# Altium schematic sheet 14.SchDoc
size 513 x 386 mm
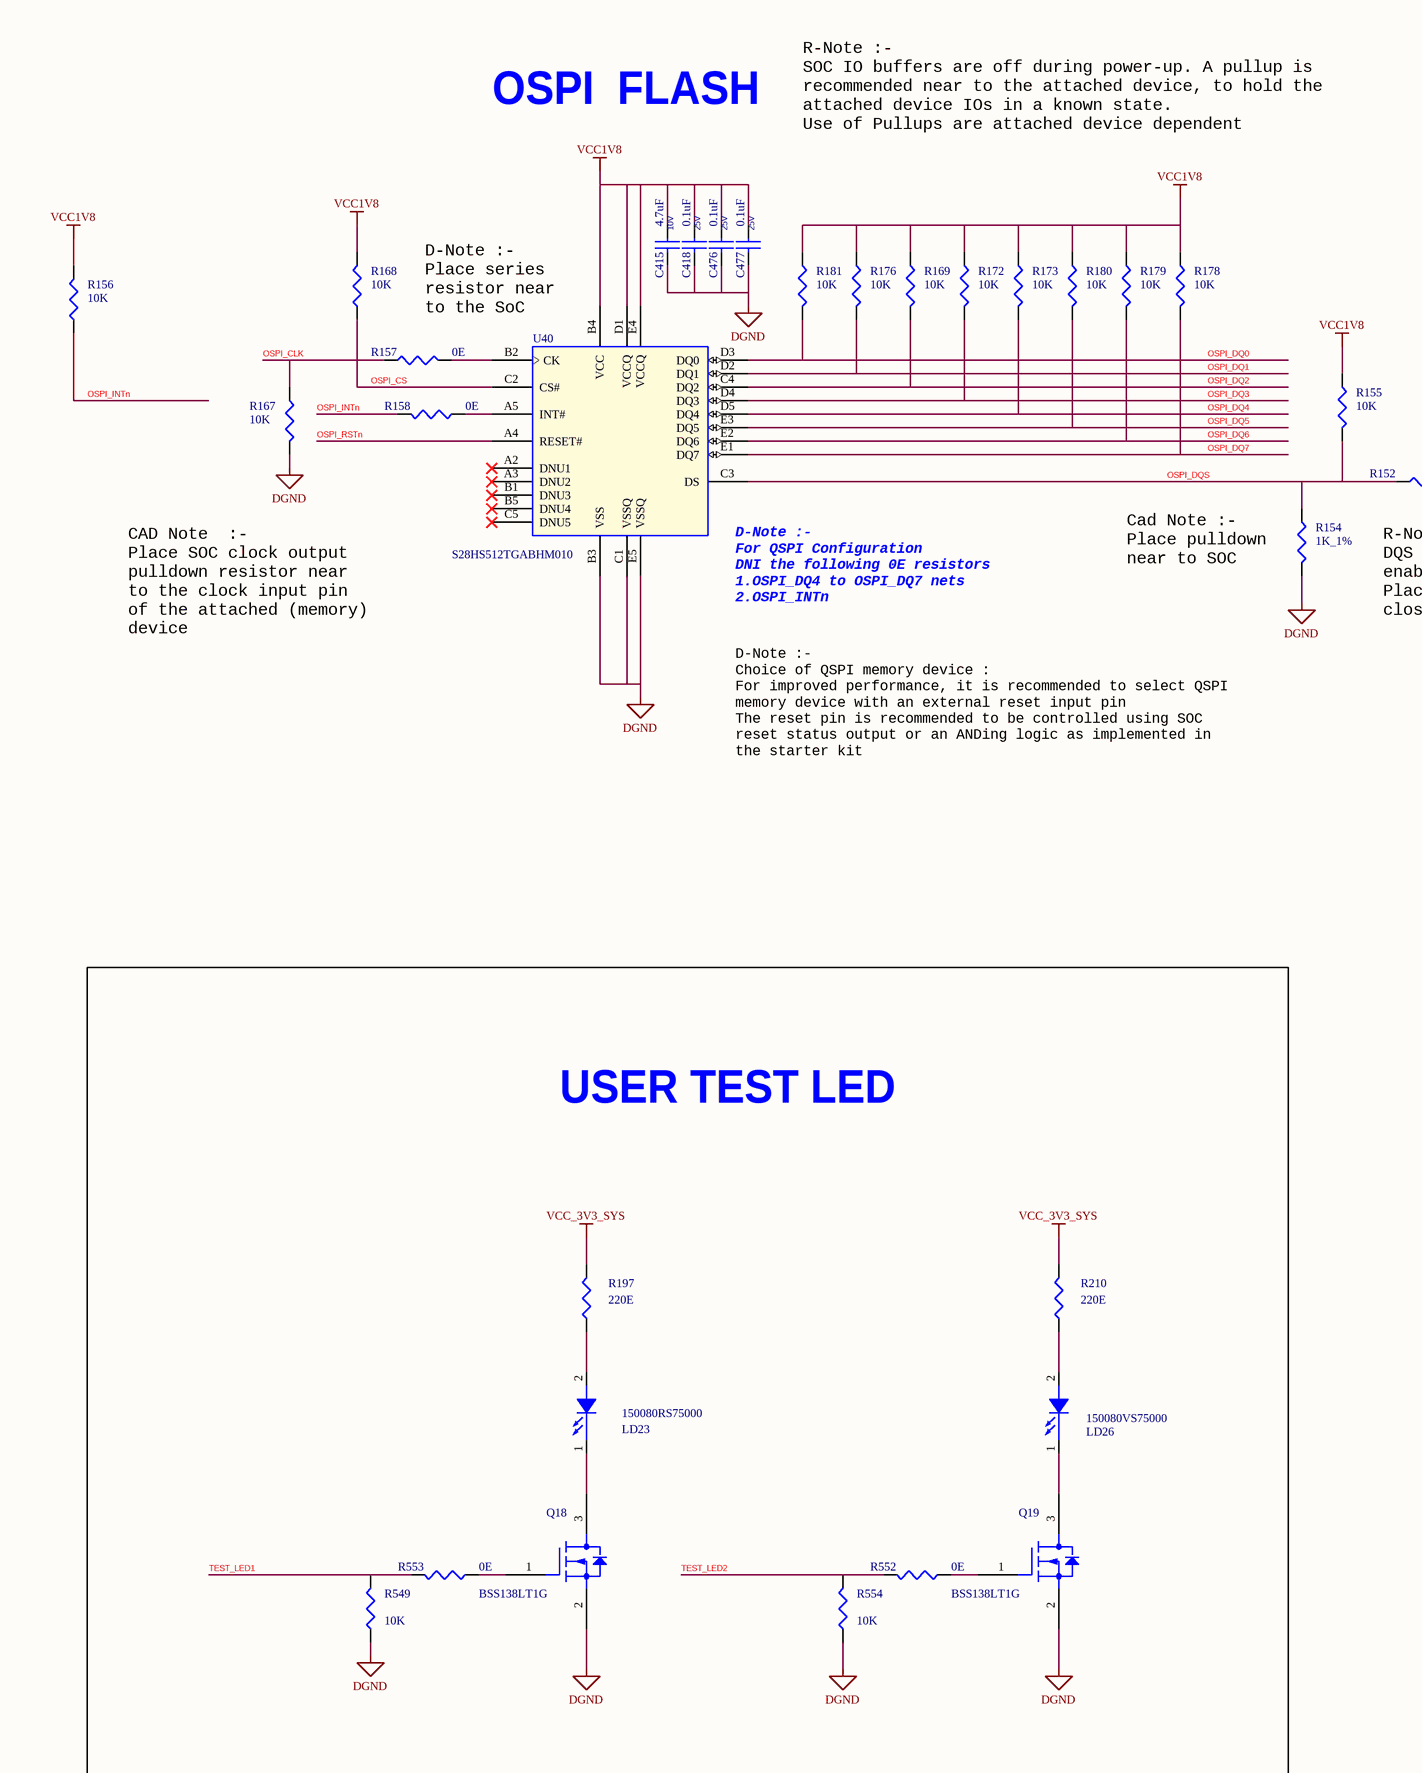
[diagram p0: 14.SchDoc, left]
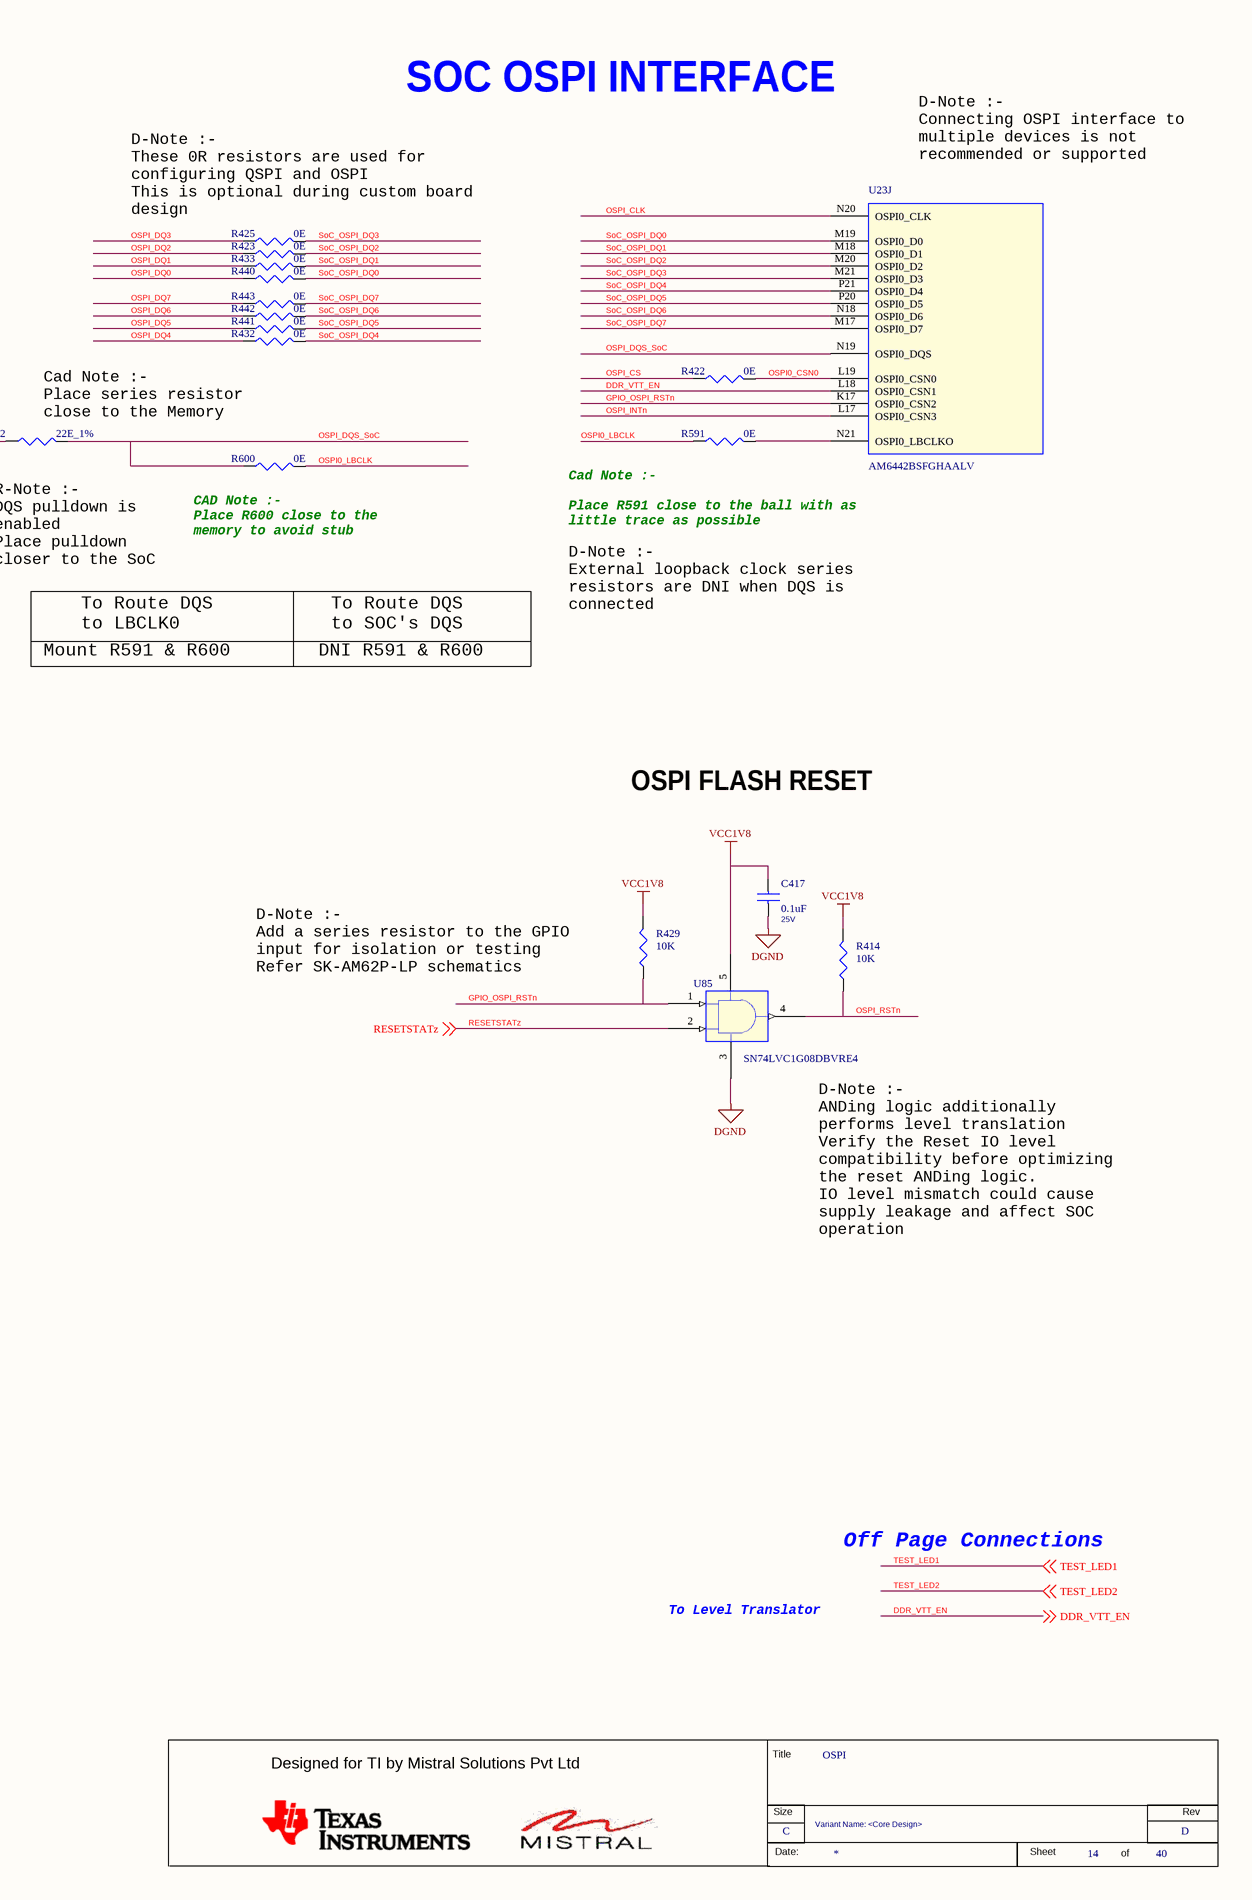
[diagram p1: 14.SchDoc, right]

## Parts
*  RevCode: D  Title: OSPI  Page Size: C  Page Number: 14  Page Count: 40  Variant Name: <Core Design>  (hidden comment: MISTRAL_TITLEBLK_CSIZE)  (graphical)
C415  4.7uF  Voltage: 10V  [CAP0402_0-75]
C417  0.1uF  Voltage: 25V  [CAP0402_0-75]
C418  0.1uF  Voltage: 25V  [CAP0402_0-75]
C476  0.1uF  Voltage: 25V  [CAP0402_0-75]
C477  0.1uF  Voltage: 25V  [CAP0402_0-75]
LD23  150080RS75000  [LED_150080VS75000_80X50_SMD_0-8]
LD26  150080VS75000  [LED_150080VS75000_80X50_SMD_0-8]
Q18  BSS138LT1G  [SOT23-123_1-2]
Q19  BSS138LT1G  [SOT23-123_1-2]
R152  22E_1%  [RES0402_0-5]
R154  1K_1%  [RES0402_0-5]
R155  10K  [RES0402_0-5]
R156  10K  [RES0402_0-5]
R157  0E  [RES0402N]
R158  0E  [RES0402_0-5]
R167  10K  [RES0402_0-5]
R168  10K  [RES0402_0-5]
R169  10K  [RES0402_0-5]
R172  10K  [RES0402_0-5]
R173  10K  [RES0402_0-5]
R176  10K  [RES0402_0-5]
R178  10K  [RES0402_0-5]
R179  10K  [RES0402_0-5]
R180  10K  [RES0402_0-5]
R181  10K  [RES0402_0-5]
R197  220E  [RES0402_0-5]
R210  220E  [RES0402_0-5]
R414  10K  [RES0402_0-5]
R422  0E  [RES0402_0-5]
R423  0E  [RES0402_0-5]
R425  0E  [RES0402_0-5]
R429  10K  [RES0402_0-5]
R432  0E  [RES0402_0-5]
R433  0E  [RES0402_0-5]
R440  0E  [RES0402_0-5]
R441  0E  [RES0402_0-5]
R442  0E  [RES0402_0-5]
R443  0E  [RES0402_0-5]
R549  10K  [RES0402_0-5]
R552  0E  [RES0402_0-5]
R553  0E  [RES0402_0-5]
R554  10K  [RES0402_0-5]
R591  0E  [RES0402_0-5]
R600  0E  [RES0402_0-5]
U23  AM6442BSFGHAALV  [FCBGA441_31-49_680X680_2-6]  (part J of 16)
U40  S28HS512TGABHM010  [BGA24_39-37_240X310_1]
U85  SN74LVC1G08DBVRE4  [SOT23-5]

## Blocks framed on the sheet
USER TEST LED: LD23 LD26 Q18 Q19 R197 R210 R549 R552-R554

## Nets
DGND: C415.2 C417.2 C418.2 C476.2 C477.2 Q18.2(S) Q19.2(S) R154.2 R167.2 R549.1 R554.1 U40.B3(VSS) U40.C1(VSSQ) U40.E5(VSSQ) U85.3(GND)
VCC1V8: C415.1 C417.1 C418.1 C476.1 C477.1 R155.1 R156.2 R168.2 R169.1 R172.1 R173.1 R176.1 R178.1 R179.1 R180.1 R181.1 R414.2 R429.2 U40.B4(VCC) U40.D1(VCCQ) U40.E4(VCCQ) U85.5(VCC)
VCC_3V3_SYS: R197.2 R210.2
DDR_VTT_EN: U23.L18(OSPI0_CSN1) ; off-sheet DDR_VTT_EN
GPIO_OSPI_RSTn: R429.1 U23.K17(OSPI0_CSN2) U85.1(A)
OSPI0_CSN0: R422.2 U23.L19(OSPI0_CSN0)
OSPI0_LBCLK: R591.1 R600.2
OSPI_CLK: R157.1 R167.1 U23.N20(OSPI0_CLK)
OSPI_CS: R168.1 R422.1 U40.C2(CS#)
OSPI_DQ0: R181.2 R440.1 U40.D3(DQ0)
OSPI_DQ1: R176.2 R433.1 U40.D2(DQ1)
OSPI_DQ2: R169.2 R423.1 U40.C4(DQ2)
OSPI_DQ3: R172.2 R425.1 U40.D4(DQ3)
OSPI_DQ4: R173.2 R432.1 U40.D5(DQ4)
OSPI_DQ5: R180.2 R441.1 U40.E3(DQ5)
OSPI_DQ6: R179.2 R442.1 U40.E2(DQ6)
OSPI_DQ7: R178.2 R443.1 U40.E1(DQ7)
OSPI_DQS: R152.1 R154.1 R155.2 U40.C3(DS)
OSPI_DQS_SoC: R152.2 R600.1 U23.N19(OSPI0_DQS)
OSPI_INTn: R156.1 R158.2 U23.L17(OSPI0_CSN3)
OSPI_RSTn: R414.1 U40.A4(RESET#) U85.4(Y)
RESETSTATz: U85.2(B) ; off-sheet RESETSTATz
SoC_OSPI_DQ0: R440.2 U23.M19(OSPI0_D0)
SoC_OSPI_DQ1: R433.2 U23.M18(OSPI0_D1)
SoC_OSPI_DQ2: R423.2 U23.M20(OSPI0_D2)
SoC_OSPI_DQ3: R425.2 U23.M21(OSPI0_D3)
SoC_OSPI_DQ4: R432.2 U23.P21(OSPI0_D4)
SoC_OSPI_DQ5: R441.2 U23.P20(OSPI0_D5)
SoC_OSPI_DQ6: R442.2 U23.N18(OSPI0_D6)
SoC_OSPI_DQ7: R443.2 U23.M17(OSPI0_D7)
TEST_LED1: R549.2 R553.2 ; off-sheet TEST_LED1
TEST_LED2: R552.2 R554.2 ; off-sheet TEST_LED2
NetLD23_1: LD23.1(CATHODE) Q18.3(D)
NetLD23_2: LD23.2(ANODE) R197.1
NetLD26_1: LD26.1(CATHODE) Q19.3(D)
NetLD26_2: LD26.2(ANODE) R210.1
NetQ18_1: Q18.1(G) R553.1
NetQ19_1: Q19.1(G) R552.1
NetR157_2: R157.2 U40.B2(CK)
NetR158_1: R158.1 U40.A5(INT#)
NetR591_2: R591.2 U23.N21(OSPI0_LBCLKO)

Not connected (* = marked no-connect by the designer): U40 A2(DNU1)* A3(DNU2)* B1(DNU3)* B5(DNU4)* C5(DNU5)*

## Notes on the sheet
- R-Note :-
  SOC IO buffers are off during power-up. A pullup is
  recommended near to the attached device, to hold the
  attached device IOs in a known state.
  Use of Pullups are attached device dependent
- D-Note :-
  Connecting OSPI interface to
  multiple devices is not
  recommended or supported
- OSPI  FLASH
- D-Note :-
  These 0R resistors are used for
  configuring QSPI and OSPI
  This is optional during custom board
  design
- SOC OSPI INTERFACE
- D-Note :-
  Place series
  resistor near
  to the SoC
- Cad Note :-
  Place series resistor
  close to the Memory
- (near R154) Cad Note :-
  Place pulldown
  near to SOC
- Cad Note :-
  Place R591 close to the ball with as
  little trace as possible
- CAD Note  :-
  Place SOC clock output
  pulldown resistor near
  to the clock input pin
  of the attached (memory)
  device
- (near U40) D-Note :-
  For QSPI Configuration
  DNI the following 0E resistors
  1.OSPI_DQ4 to OSPI_DQ7 nets
  2.OSPI_INTn
- (near R152) R-Note :-
  DQS pulldown is
  enabled
  Place pulldown
  closer to the SoC
- (near R600) CAD Note :-
  Place R600 close to the
  memory to avoid stub
- D-Note :-
  Choice of QSPI memory device :
  For improved performance, it is recommended to select QSPI
  memory device with an external reset input pin
  The reset pin is recommended to be controlled using SOC
  reset status output or an ANDing logic as implemented in
  the starter kit
- To Route DQS
  to LBCLK0
- To Route DQS
  to SOC's DQS
- D-Note :-
  External loopback clock series
  resistors are DNI when DQS is
  connected
- Mount R591 & R600
- DNI R591 & R600
- OSPI FLASH RESET
- D-Note :-
  Add a series resistor to the GPIO
  input for isolation or testing
  Refer SK-AM62P-LP schematics
- D-Note :-
  ANDing logic additionally
  performs level translation
  Verify the Reset IO level
  compatibility before optimizing
  the reset ANDing logic.
  IO level mismatch could cause
  supply leakage and affect SOC
  operation
- Off Page Connections
- To Level Translator
- (in symbol MISTRAL_TITLEBLK_CSIZE) Title; Designed for TI by Mistral Solutions Pvt Ltd; Size; Rev; Date:; Sheet; of

## Library data of the parts
* = MISTRAL_TITLEBLK_CSIZE: Issue: 1.0; Page Create Date: March  8, 1995; Page Modify Date: *
C415 = CAP_Dup3: CAP CERAMIC 4.7uF 10V 20% X5R 0402; Mistral Part No: 120012060002-R; Mfr_name: AVX CORPORATION; Mfr_part_number: 0402ZD475MAT2A; Part_type: CAPACITORS\CERAMIC; Project: TI_MAXIE_CPB; Wattage: NA; Customs_HS_Code: 85322990; Custom_Duty: 15%; PCB Footprint: CAP0402_0-75; Footprint Path: Y:\MIS_DATABASE\Library\ALTIUM_TOOL\PCB_FOOTPRINTS\Altium_Footprint_Lib.PcbLib; Library Path: Y:\MIS_DATABASE\Library\ALTIUM_TOOL\SCHEMATICS_PARTS\MS_DISCRETE_Library.schlib; Footprint Ref: CAP0402_0-75; Tolerance: 20%; Package: 0402; Distributor_name: DIGIKEY; Distributor_part_number: 478-10791-1-ND; Height: 0.71MM; Weight: 0.65mg; Temperature: -55癈+85癈; Datasheet: Y:\MIS_DATABASE\DATASHEETS\CAPACITORS\AVX_MLC.PDF; Crtd /date: MANIRAJA/230118; Chkd/date: MANIRAJA/230118; MECHANICAL 3D STEP FILE: CAP0402_0-75; Library Ref: CAP
C417 C418 C477 = CAP_Dup3: CAP CERAMIC 0.1uF 25V 20% X5R 0402; Alt_Mfr_name: YAGEO AMERICA; Part_type: CAPACITORS\CERAMIC; Mfr_part_number: 885012105018; Mfr_name: WURTH ELECTRONICS; Mistral Part No: 120020080003-R; Alt_Mfr_part_number: CC0402KRX5R8BB104; Custom_Duty: 15%; Customs_HS_Code: 85322990; Wattage: NA; Project: AM64x_EVM_BRD; PCB Footprint: CAP0402_0-75; Footprint Path: Y:\MIS_DATABASE\Library\ALTIUM_TOOL\PCB_FOOTPRINTS\Altium_Footprint_Lib.PcbLib; Library Path: Y:\MIS_DATABASE\Library\ALTIUM_TOOL\SCHEMATICS_PARTS\MS_DISCRETE_Library.schlib; Footprint Ref: CAP0402_0-75; Library Ref: CAP; MECHANICAL 3D STEP FILE: CAP0402_0-75; Chkd/date: MANIRAJA/170820; Crtd /date: ALVY/170820; Datasheet: Y:\MIS_DATABASE\DATASHEETS\CAPACITORS\885012105018.PDF; Temperature: -55癈+85癈; Weight: 0.65mg; Height: 0.55MM; Distributor_part_number: 732-7495-1-ND; Distributor_name: DIGIKEY; Package: 0402; Tolerance: 20%
C476 = CAP_Dup3: CAP CERAMIC 0.1uF 25V 20% X5R 0402; Alt_Mfr_part_number: CC0402KRX5R8BB104; Mistral Part No: 120020080003-R; Mfr_name: WURTH ELECTRONICS; Mfr_part_number: 885012105018; Part_type: CAPACITORS\CERAMIC; Alt_Mfr_name: YAGEO AMERICA; Project: AM64x_EVM_BRD; Wattage: NA; Customs_HS_Code: 85322990; Custom_Duty: 15%; PCB Footprint: CAP0402_0-75; Tolerance: 20%; Package: 0402; Distributor_name: DIGIKEY; Distributor_part_number: 732-7495-1-ND; Height: 0.55MM; Weight: 0.65mg; Temperature: -55癈+85癈; Datasheet: Y:\MIS_DATABASE\DATASHEETS\CAPACITORS\885012105018.PDF; Crtd /date: ALVY/170820; Chkd/date: MANIRAJA/170820; MECHANICAL 3D STEP FILE: CAP0402_0-75; Library Ref: CAP; Footprint Ref: CAP0402_0-75; Library Path: Y:\MIS_DATABASE\Library\ALTIUM_TOOL\SCHEMATICS_PARTS\MS_DISCRETE_Library.schlib; Footprint Path: Y:\MIS_DATABASE\Library\ALTIUM_TOOL\PCB_FOOTPRINTS\Altium_Footprint_Lib.PcbLib
LD23 = DIODE_LED: DIODE LED RED SMD; Part_type: OPTO\LED; Mfr_name: WURTH ELECTRONICS; Mistral Part No: 130020080013-R; Custom_Duty: 24%; Customs_HS_Code: 85439000; Wattage: NA; Project: AM64x_EVM_BRD; Footprint Path: Y:\MIS_DATABASE\Library\ALTIUM_TOOL\PCB_FOOTPRINTS\Altium_Footprint_Lib.PcbLib; Library Path: Y:\MIS_DATABASE\Library\ALTIUM_TOOL\SCHEMATICS_PARTS\MS_OPTO_Library.schlib; MECHANICAL 3D STEP FILE: LED_150080VS75000_80X50_SMD_0-8; Chkd/date: MANIRAJA/180820; Crtd /date: ALVY/180820; Datasheet: Y:\MIS_DATABASE\DATASHEETS\DISCRETES\LEDS\150080RS75000.PDF; Temperature: -40癈+85癈; Weight: 25mg; Height: 0.80MM; Library Ref: DIODE_LED; Distributor_part_number: 732-4984-1-ND; Distributor_name: DIGIKEY; Package: SMD; Voltage: NA; Tolerance: NA; Mfr_part_number: 150080RS75000; Footprint Ref: LED_150080VS75000_80X50_SMD_0-8; PCB Footprint: LED_150080VS75000_80X50_SMD_0-8
LD26 = DIODE_LED: DIODE LED BRIGHT GREEN SMD; Mistral Part No: 130020080012-R; Mfr_name: WURTH ELECTRONICS; Part_type: OPTO\LED; Project: AM64x_EVM_BRD; Tolerance: NA; Customs_HS_Code: 85439000; Custom_Duty: 24%; Mfr_part_number: 150080VS75000; Voltage: NA; Wattage: NA; Package: SMD; Distributor_name: DIGIKEY; Distributor_part_number: 732-4986-1-ND; Library Ref: DIODE_LED; Footprint Ref: LED_150080VS75000_80X50_SMD_0-8; Height: 0.80MM; Weight: 10mg; Temperature: -40癈+85癈; Datasheet: Y:\MIS_DATABASE\DATASHEETS\DISCRETES\LEDS\150080VS75000.PDF; Crtd /date: ALVY/180820; Chkd/date: MANIRAJA/180820; MECHANICAL 3D STEP FILE: LED_150080VS75000_80X50_SMD_0-8; Library Path: Y:\MIS_DATABASE\Library\ALTIUM_TOOL\SCHEMATICS_PARTS\MS_OPTO_Library.schlib; Footprint Path: Y:\MIS_DATABASE\Library\ALTIUM_TOOL\PCB_FOOTPRINTS\Altium_Footprint_Lib.PcbLib; PCB Footprint: LED_150080VS75000_80X50_SMD_0-8
Q18 = MOSFET_BSS138LT1G: IC MOSFET N-CHANNEL 50V 200mA SOT23-3; Part_type: ICS\POWER\MOSFET; Mfr_name: ON SEMICONDUCTOR; Mistral Part No: 142016040001-R; Custom_Duty: 15%; Customs_HS_Code: 85423100; Wattage: NA; Project: LRDE_ABCM; PCB Footprint: SOT23-123_1-2; Footprint Path: Y:\MIS_DATABASE\Library\ALTIUM_TOOL\PCB_FOOTPRINTS\Altium_Footprint_Lib.PcbLib; Library Path: Y:\MIS_DATABASE\Library\ALTIUM_TOOL\SCHEMATICS_PARTS\MS_MOSFET_Library.schlib; MECHANICAL 3D STEP FILE: SOT23-123_1-2; Footprint Ref: SOT23-123_1-2; Chkd/date: MANIRAJA/250219; Crtd /date: JEBRAN/060416; Datasheet: Y:\MIS_DATABASE\DATASHEETS\DISCRETES\TRANSISTORS_FETS\BSS138LT1G.PDF; Temperature: -55癈+150癈; Weight: 8mg; Height: 1.11MM; Distributor_part_number: BSS138LT1GOSCT-ND; Distributor_name: DIGIKEY; Package: SOT23-3; Voltage: NA; Tolerance: NA; Mfr_part_number: BSS138LT1G; Library Ref: MOSFET_BSS138W
Q19 = MOSFET_BSS138LT1G: IC MOSFET N-CHANNEL 50V 200mA SOT23-3; Mistral Part No: 142016040001-R; Mfr_name: ON SEMICONDUCTOR; Part_type: ICS\POWER\MOSFET; Project: LRDE_ABCM; Tolerance: NA; Customs_HS_Code: 85423100; Custom_Duty: 15%; PCB Footprint: SOT23-123_1-2; Library Ref: MOSFET_BSS138W; Mfr_part_number: BSS138LT1G; Voltage: NA; Wattage: NA; Package: SOT23-3; Distributor_name: DIGIKEY; Distributor_part_number: BSS138LT1GOSCT-ND; Height: 1.11MM; Weight: 8mg; Temperature: -55癈+150癈; Datasheet: Y:\MIS_DATABASE\DATASHEETS\DISCRETES\TRANSISTORS_FETS\BSS138LT1G.PDF; Crtd /date: JEBRAN/060416; Chkd/date: MANIRAJA/250219; Footprint Ref: SOT23-123_1-2; MECHANICAL 3D STEP FILE: SOT23-123_1-2; Library Path: Y:\MIS_DATABASE\Library\ALTIUM_TOOL\SCHEMATICS_PARTS\MS_MOSFET_Library.schlib; Footprint Path: Y:\MIS_DATABASE\Library\ALTIUM_TOOL\PCB_FOOTPRINTS\Altium_Footprint_Lib.PcbLib
R152 = RESISTOR_Dup5: RES 22E 1/16W 1% 0402; Cust_part_number: 4700-80047E; Part_type: RESISTORS\FIXED; Mfr_part_number: RC0402FR-0722RL; Mfr_name: YAGEO AMERICA; Mistral Part No: 110009090004-R; Custom_Duty: 15%; Customs_HS_Code: 85332119; Voltage: NA; Project: VMEFMCD; SIGNAL_MODEL: RESISTOR_RES0402_22E_22E; PCB Footprint: RES0402_0-5; Footprint Path: Y:\MIS_DATABASE\Library\ALTIUM_TOOL\PCB_FOOTPRINTS\Altium_Footprint_Lib.PcbLib; Library Path: Y:\MIS_DATABASE\Library\ALTIUM_TOOL\SCHEMATICS_PARTS\MS_DISCRETE_Library.schlib; MECHANICAL 3D STEP FILE: RES0402_0-5; Footprint Ref: RES0402_0-5; Chkd/date: SUHAS/290910; Crtd /date: MAZHAR/090909; Datasheet: Y:\MIS_DATABASE\DATASHEETS\RESISTORS\RCXXXXL-SER_MAR18.PDF; Temperature: -55癈+155癈; Weight: 0.65mg; Height: 0.40MM; Distributor_part_number: 311-22.0LRCT-ND; Distributor_name: DIGIKEY; Package: 0402; Wattage: 1/16W; Tolerance: 1%; Library Ref: RESISTOR
R154 = RESISTOR_Dup5: RES 1K 1/10W 1% 0402; Part_type: RESISTORS\FIXED; Mfr_part_number: ERJ-2RKF1001X; Mfr_name: PANASONIC-ECG; Mistral Part No: 110009030411-R; Custom_Duty: 15%; Customs_HS_Code: 85332119; Voltage: NA; Project: VOCERA; PCB Footprint: RES0402_0-5; Chkd/date: VASANTHA/281216; Crtd /date: MAZHAR/150506; Datasheet: Y:\MIS_DATABASE\DATASHEETS\RESISTORS\PAN-ERJSER_NOV17.PDF; Temperature: -55癈+155癈; Weight: 0.8mg; Height: 0.40MM; Distributor_part_number: P1.00KLCT-ND; Distributor_name: DIGIKEY; Package: 0402; Wattage: 1/10W; Tolerance: 1%; Library Ref: RESISTOR; Footprint Ref: RES0402_0-5; MECHANICAL 3D STEP FILE: RES0402_0-5; Library Path: Y:\MIS_DATABASE\Library\ALTIUM_TOOL\SCHEMATICS_PARTS\MS_DISCRETE_Library.schlib; Footprint Path: Y:\MIS_DATABASE\Library\ALTIUM_TOOL\PCB_FOOTPRINTS\Altium_Footprint_Lib.PcbLib
R155 R181 R429 R554 = RESISTOR_Dup6: RES 10K 1/16W 5% 0402; Mistral Part No: 110011060021-R; Mfr_name: YAGEO AMERICA; Mfr_part_number: RC0402JR-0710KL; Part_type: RESISTORS\FIXED; Project: HSE; Voltage: NA; Customs_HS_Code: 85332119; Custom_Duty: 15%; PCB Footprint: RES0402_0-5; Footprint Path: Y:\MIS_DATABASE\Library\ALTIUM_TOOL\PCB_FOOTPRINTS\Altium_Footprint_Lib.PcbLib; Library Path: Y:\MIS_DATABASE\Library\ALTIUM_TOOL\SCHEMATICS_PARTS\MS_DISCRETE_Library.schlib; Footprint Ref: RES0402_0-5; Library Ref: RESISTOR; Tolerance: 5%; Wattage: 1/16W; Package: 0402; Distributor_name: DIGIKEY; Distributor_part_number: 311-10KJRCT-ND; Height: 0.40MM; Weight: 0.65mg; Temperature: -55癈+155癈; Datasheet: Y:\MIS_DATABASE\DATASHEETS\RESISTORS\RCXXXXL-SER_MAR18.PDF; Crtd /date: MAZHAR/230805; Chkd/date: VASANTHA/061216; MECHANICAL 3D STEP FILE: RES0402_0-5
R156 R168 R169 R172 R173 R176 R178-R180 R414 R549 = RESISTOR_Dup6: RES 10K 1/16W 5% 0402; Part_type: RESISTORS\FIXED; Mfr_part_number: RC0402JR-0710KL; Mfr_name: YAGEO AMERICA; Mistral Part No: 110011060021-R; Custom_Duty: 15%; Customs_HS_Code: 85332119; Voltage: NA; Project: HSE; PCB Footprint: RES0402_0-5; Footprint Path: Y:\MIS_DATABASE\Library\ALTIUM_TOOL\PCB_FOOTPRINTS\Altium_Footprint_Lib.PcbLib; Library Path: Y:\MIS_DATABASE\Library\ALTIUM_TOOL\SCHEMATICS_PARTS\MS_DISCRETE_Library.schlib; Footprint Ref: RES0402_0-5; Library Ref: RESISTOR; MECHANICAL 3D STEP FILE: RES0402_0-5; Chkd/date: VASANTHA/061216; Crtd /date: MAZHAR/230805; Datasheet: Y:\MIS_DATABASE\DATASHEETS\RESISTORS\RCXXXXL-SER_MAR18.PDF; Temperature: -55癈+155癈; Weight: 0.65mg; Height: 0.40MM; Distributor_part_number: 311-10KJRCT-ND; Distributor_name: DIGIKEY; Package: 0402; Wattage: 1/16W; Tolerance: 5%
R157 = RESISTOR_Dup3: RES 0E 1/16W JUMPER 0402; Mistral Part No: 110010080019-R; Mfr_name: VISHAY; Mfr_part_number: CRCW04020000Z0ED; Part_type: RESISTORS\FIXED; PCB Footprint: RES0402_0-5; Voltage: NA; Project: PB_BUGBASE; Customs_HS_Code: 85332119; Custom_Duty: 15%; MECHANICAL 3D STEP FILE: RES0402_0-5; Temperature: -55癈+155癈; Weight: 0.65mg; Tolerance: NA; Wattage: 1/16W; Package: 0402; Distributor_name: DIGIKEY; Distributor_part_number: 541-0.0JCT-ND; Height: 0.40MM; Datasheet: Y:\MIS_DATABASE\DATASHEETS\RESISTORS\CRCW0603.PDF; Crtd /date: MUDDU/190810; Chkd/date: VASANTHA/201216; Library Ref: RESISTOR; Footprint Ref: RES0402_0-5; Library Path: Y:\MIS_DATABASE\Library\ALTIUM_TOOL\SCHEMATICS_PARTS\MS_DISCRETE_Library.schlib; Footprint Path: Y:\MIS_DATABASE\Library\ALTIUM_TOOL\PCB_FOOTPRINTS\Altium_Footprint_Lib.PcbLib
R158 R422 R432 R441-R443 R552 R591 R600 = RESISTOR_Dup5: RES 0E 1/16W JUMPER 0402; Mistral Part No: 110010080019-R; Mfr_name: VISHAY; Mfr_part_number: CRCW04020000Z0ED; Part_type: RESISTORS\FIXED; Project: PB_BUGBASE; Tolerance: NA; Customs_HS_Code: 85332119; Custom_Duty: 15%; PCB Footprint: RES0402_0-5; Footprint Path: Y:\MIS_DATABASE\Library\ALTIUM_TOOL\PCB_FOOTPRINTS\Altium_Footprint_Lib.PcbLib; Library Path: Y:\MIS_DATABASE\Library\ALTIUM_TOOL\SCHEMATICS_PARTS\MS_DISCRETE_Library.schlib; Footprint Ref: RES0402_0-5; Library Ref: RESISTOR; Voltage: NA; Wattage: 1/16W; Package: 0402; Distributor_name: DIGIKEY; Distributor_part_number: 541-0.0JCT-ND; Height: 0.40MM; Weight: 0.65mg; Temperature: -55癈+155癈; Datasheet: Y:\MIS_DATABASE\DATASHEETS\RESISTORS\CRCW0603.PDF; Crtd /date: MUDDU/190810; Chkd/date: VASANTHA/201216; MECHANICAL 3D STEP FILE: RES0402_0-5
R167 = RESISTOR_Dup5: RES 10K 1/16W 5% 0402; Part_type: RESISTORS\FIXED; Mfr_part_number: RC0402JR-0710KL; Mfr_name: YAGEO AMERICA; Mistral Part No: 110011060021-R; Custom_Duty: 15%; Customs_HS_Code: 85332119; Voltage: NA; Project: HSE; PCB Footprint: RES0402_0-5; Footprint Path: Y:\MIS_DATABASE\Library\ALTIUM_TOOL\PCB_FOOTPRINTS\Altium_Footprint_Lib.PcbLib; Library Path: Y:\MIS_DATABASE\Library\ALTIUM_TOOL\SCHEMATICS_PARTS\MS_DISCRETE_Library.schlib; Footprint Ref: RES0402_0-5; Chkd/date: VASANTHA/061216; Crtd /date: MAZHAR/230805; Datasheet: Y:\MIS_DATABASE\DATASHEETS\RESISTORS\RCXXXXL-SER_MAR18.PDF; Temperature: -55癈+155癈; Weight: 0.65mg; Height: 0.40MM; Distributor_part_number: 311-10KJRCT-ND; Distributor_name: DIGIKEY; Package: 0402; Wattage: 1/16W; Tolerance: 5%; MECHANICAL 3D STEP FILE: RES0402_0-5; Library Ref: RESISTOR
R197 = RESISTOR_Dup6: RES 220E 1/10W 5% 0402; Part_type: RESISTORS\FIXED; Mfr_part_number: ERJ-2GEJ221X; Mfr_name: PANASONIC-ECG; Mistral Part No: 110009030506-R; Custom_Duty: 15%; Customs_HS_Code: 85332119; Project: RED EYE; Voltage: NA; PCB Footprint: RES0402_0-5; Footprint Ref: RES0402_0-5; Chkd/date: VASANTHA/291216; Crtd /date: GEETHA/260406; Datasheet: Y:\MIS_DATABASE\DATASHEETS\RESISTORS\PAN-ERJSER_NOV17.PDF; Height: 0.40MM; Distributor_part_number: P220JCT-ND; Distributor_name: DIGIKEY; Package: 0402; Wattage: 1/10W; Tolerance: 5%; Library Ref: RESISTOR; Weight: 0.8mg; Temperature: -55癈+155癈; MECHANICAL 3D STEP FILE: RES0402_0-5; Library Path: Y:\MIS_DATABASE\Library\ALTIUM_TOOL\SCHEMATICS_PARTS\MS_DISCRETE_Library.schlib; Footprint Path: Y:\MIS_DATABASE\Library\ALTIUM_TOOL\PCB_FOOTPRINTS\Altium_Footprint_Lib.PcbLib
R210 = RESISTOR_Dup6: RES 220E 1/10W 5% 0402; Mistral Part No: 110009030506-R; Mfr_name: PANASONIC-ECG; Mfr_part_number: ERJ-2GEJ221X; Part_type: RESISTORS\FIXED; Voltage: NA; Project: RED EYE; Customs_HS_Code: 85332119; Custom_Duty: 15%; PCB Footprint: RES0402_0-5; Footprint Path: Y:\MIS_DATABASE\Library\ALTIUM_TOOL\PCB_FOOTPRINTS\Altium_Footprint_Lib.PcbLib; Library Path: Y:\MIS_DATABASE\Library\ALTIUM_TOOL\SCHEMATICS_PARTS\MS_DISCRETE_Library.schlib; MECHANICAL 3D STEP FILE: RES0402_0-5; Temperature: -55癈+155癈; Weight: 0.8mg; Library Ref: RESISTOR; Tolerance: 5%; Wattage: 1/10W; Package: 0402; Distributor_name: DIGIKEY; Distributor_part_number: P220JCT-ND; Height: 0.40MM; Datasheet: Y:\MIS_DATABASE\DATASHEETS\RESISTORS\PAN-ERJSER_NOV17.PDF; Crtd /date: GEETHA/260406; Chkd/date: VASANTHA/291216; Footprint Ref: RES0402_0-5
R423 R425 R433 R440 R553 = RESISTOR_Dup5: RES 0E 1/16W JUMPER 0402; Part_type: RESISTORS\FIXED; Mfr_part_number: CRCW04020000Z0ED; Mfr_name: VISHAY; Mistral Part No: 110010080019-R; Custom_Duty: 15%; Customs_HS_Code: 85332119; Voltage: NA; Project: PB_BUGBASE; PCB Footprint: RES0402_0-5; MECHANICAL 3D STEP FILE: RES0402_0-5; Chkd/date: VASANTHA/201216; Crtd /date: MUDDU/190810; Datasheet: Y:\MIS_DATABASE\DATASHEETS\RESISTORS\CRCW0603.PDF; Temperature: -55癈+155癈; Weight: 0.65mg; Height: 0.40MM; Distributor_part_number: 541-0.0JCT-ND; Distributor_name: DIGIKEY; Package: 0402; Wattage: 1/16W; Tolerance: NA; Library Ref: RESISTOR; Footprint Ref: RES0402_0-5; Library Path: Y:\MIS_DATABASE\Library\ALTIUM_TOOL\SCHEMATICS_PARTS\MS_DISCRETE_Library.schlib; Footprint Path: Y:\MIS_DATABASE\Library\ALTIUM_TOOL\PCB_FOOTPRINTS\Altium_Footprint_Lib.PcbLib
U23 = XAM6442BSFGGAALV_BGA441: IC AM64x SoC MICROPROCESSOR BGA441; Part_type: ICS\DIGITAL\MICROPROCESSOR; Mfr_name: TEXAS INSTRUMENTS; Mistral Part No: 141220080002; Custom_Duty: 15%; Customs_HS_Code: 85423100; Wattage: NA; Project: AM64x-GP_EVM BRD; Footprint Path: Y:\MIS_DATABASE\Library\ALTIUM_TOOL\PCB_FOOTPRINTS\Altium_Footprint_Lib.PcbLib; Library Path: Y:\MIS_DATABASE\Library\ALTIUM_TOOL\SCHEMATICS_PARTS\MS_MICROPROCESSOR_Library.schlib; MECHANICAL 3D STEP FILE: FCBGA441_31-49_680X680_2-6; RoHS: NA; Chkd/date: ALVY/300322; Crtd /date: ALVY/300322; Datasheet: Y:\MIS_DATABASE\DATASHEETS\ICS\DIGITAL\MICROCONTROLLER\AM64-SoC_SVB.PDF; Temperature: NA; Weight: NA; Height: 2.57MM; Library Ref: XAM6442BSFGGAALV_BGA441; Distributor_part_number: NA; Distributor_name: NA; Package: BGA441; Voltage: NA; Tolerance: NA; Mfr_part_number: AM6442BSFGHAALV; Footprint Ref: FCBGA441_31-49_680X680_2-6; PCB Footprint: FCBGA441_31-49_680X680_2-6
U40 = S28HS512T_BGA24: IC 1.8V 512Mb SEMPER FLASH WITH OCTAL INTERFACE BGA24; Mistral Part No: 141120010002; Mfr_name: CYPRESS SEMICONDUCTOR; Part_type: ICS\DIGITAL\MEMORY; Project: J7VCL_SOM DUAL LEO PMIC; Tolerance: NA; Customs_HS_Code: 85423100; Custom_Duty: 15%; Footprint Ref: BGA24_39-37_240X310_1; Mfr_part_number: S28HS512TGABHM010; Voltage: NA; Wattage: NA; Package: BGA24; Distributor_name: NA; Distributor_part_number: NA; Library Ref: S28HS512T_BGA24; Height: 1.00MM; Weight: NA; Temperature: -40癈+125癈; Datasheet: Y:\MIS_DATABASE\DATASHEETS\ICS\MEMORY\S28HS512T.PDF; Crtd /date: ALVY/170120; Chkd/date: MANIRAJA/170120; RoHS: NA; MECHANICAL 3D STEP FILE: BGA24_39-37_240X310_1; Library Path: Y:\MIS_DATABASE\Library\ALTIUM_TOOL\SCHEMATICS_PARTS\MS_MISCMEMORY_Library.schlib; Footprint Path: Y:\MIS_DATABASE\Library\ALTIUM_TOOL\PCB_FOOTPRINTS\Altium_Footprint_Lib.PcbLib; PCB Footprint: BGA24_39-37_240X310_1
U85 = SN74LVC1G08DBVRE4_SOT23-5: IC SINGLE 2-INPUT POSITIVE AND GATE SOT23-5; Mistral Part No: 141009060026-R; Mfr_name: TEXAS INSTRUMENTS; Part_type: ICS\DIGITAL\GATES; Project: KHAN_MAIN; Customs_HS_Code: 85423100; Custom_Duty: 15%; PCB Footprint: SOT23-5; Mfr_part_number: SN74LVC1G08DBVRE4; Package: SOT23-5; Distributor_name: DIGIKEY; Distributor_part_number: SN74LVC1G08DBVRE4-ND; Library Ref: SN74LVC1G08DBVRE4_SOT23-5; Height: 1.45MM; Temperature: -40癈+85癈; Datasheet: Y:\MIS_DATABASE\DATASHEETS\ICS\DIGITAL\GATES\SN74LVC1G08.PDF; Crtd /date: USMAN/151008; Chkd/date: SUHAS/221010; RoHS: Sb/ Br FREE